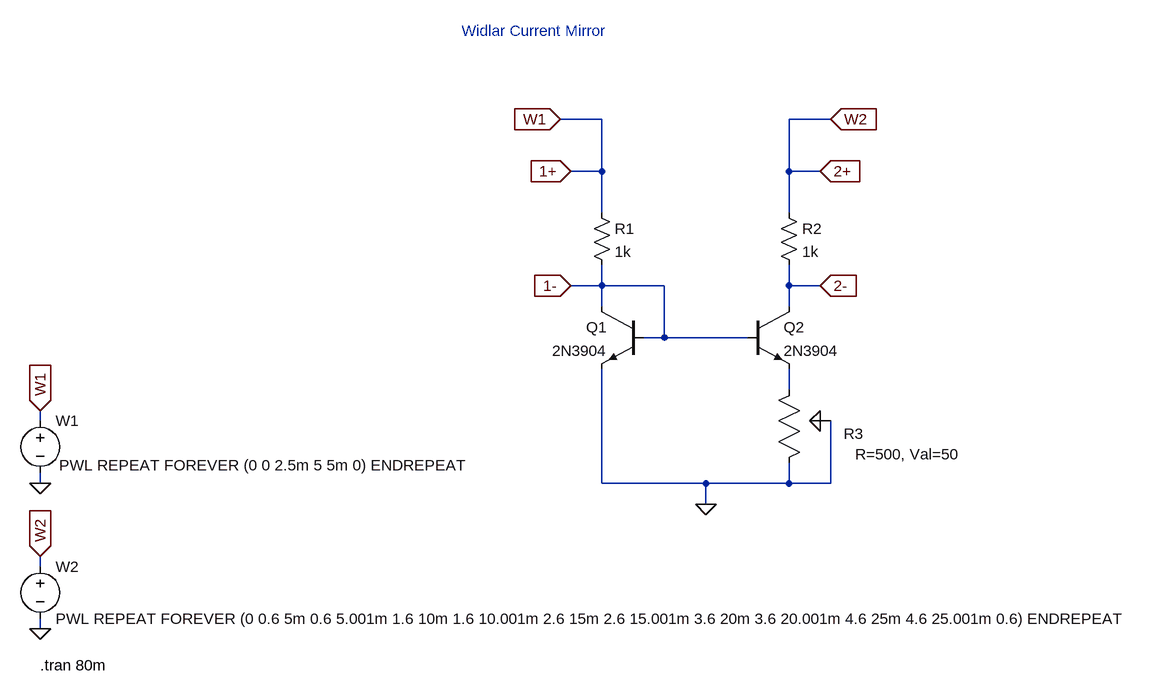
[diagram p0: schematic widlar_current_mirror.asc]
widlar_current_mirror.asc, the LTspice schematic file:
Version 4
SHEET 1 2016 1044
WIRE -208 -64 -272 -64
WIRE 144 -64 80 -64
WIRE -208 16 -208 -64
WIRE -208 16 -256 16
WIRE 80 16 80 -64
WIRE 128 16 80 16
WIRE -208 80 -208 16
WIRE 80 80 80 16
WIRE -208 192 -208 160
WIRE -208 192 -256 192
WIRE -112 192 -208 192
WIRE 80 192 80 160
WIRE 128 192 80 192
WIRE -208 224 -208 192
WIRE 80 224 80 192
WIRE -112 272 -112 192
WIRE -112 272 -144 272
WIRE 16 272 -112 272
WIRE 80 352 80 320
WIRE -1072 400 -1072 384
WIRE -1072 496 -1072 480
WIRE -208 496 -208 320
WIRE -48 496 -208 496
WIRE 80 496 80 464
WIRE 80 496 -48 496
WIRE 144 496 144 400
WIRE 144 496 80 496
WIRE -48 528 -48 496
WIRE -1072 624 -1072 608
WIRE -1072 720 -1072 704
FLAG -1072 496 0
FLAG -1072 720 0
FLAG -1072 384 W1
IOPIN -1072 384 In
FLAG -1072 608 W2
IOPIN -1072 608 In
FLAG -48 528 0
FLAG -272 -64 W1
IOPIN -272 -64 In
FLAG 144 -64 W2
IOPIN 144 -64 In
FLAG -256 16 1+
IOPIN -256 16 In
FLAG -256 192 1-
IOPIN -256 192 In
FLAG 128 16 2+
IOPIN 128 16 In
FLAG 128 192 2-
IOPIN 128 192 In
SYMBOL voltage -1072 384 R0
WINDOW 3 29 84 Left 2
WINDOW 123 0 0 Left 0
WINDOW 39 0 0 Left 0
SYMATTR Value PWL REPEAT FOREVER (0 0 2.5m 5 5m 0) ENDREPEAT
SYMATTR InstName W1
SYMBOL voltage -1072 608 R0
WINDOW 123 0 0 Left 0
WINDOW 39 0 0 Left 0
SYMATTR InstName W2
SYMATTR Value PWL REPEAT FOREVER (0 0.6 5m 0.6 5.001m 1.6 10m 1.6 10.001m 2.6 15m 2.6 15.001m 3.6 20m 3.6 20.001m 4.6 25m 4.6 25.001m 0.6) ENDREPEAT
SYMBOL res -224 64 R0
SYMATTR InstName R1
SYMATTR Value 1k
SYMBOL res 64 64 R0
SYMATTR InstName R2
SYMATTR Value 1k
SYMBOL npn -144 224 M0
SYMATTR InstName Q1
SYMATTR Value 2N3904
SYMBOL npn 16 224 R0
SYMATTR InstName Q2
SYMATTR Value 2N3904
SYMBOL potentiometer 96 368 M0
WINDOW 0 -99 52 Left 2
WINDOW 39 -247 83 Left 2
SYMATTR InstName R3
SYMATTR SpiceLine R=500, Val=50
TEXT -424 -200 Left 2 ;Widlar Current Mirror
TEXT -1072 776 Left 2 !.tran 80m

The netlist it stands for:
* widlar_current_mirror.asc
V§W1 1+ 0 PWL REPEAT FOREVER (0 0 2.5m 5 5m 0) ENDREPEAT
V§W2 2+ 0 PWL REPEAT FOREVER (0 0.6 5m 0.6 5.001m 1.6 10m 1.6 10.001m 2.6 15m 2.6 15.001m 3.6 20m 3.6 20.001m 4.6 25m 4.6 25.001m 0.6) ENDREPEAT
R1 1+ 1- 1k
R2 2+ 2- 1k
Q1 1- 1- 0 0 2N3904
Q2 2- 1- N001 0 2N3904
XR3 N001 0 0 potentiometer R=500, Val=50  ; pins 1 2 3
.model NPN NPN
.model PNP PNP
.lib standard.bjt
* Widlar Current Mirror
.tran 80m
.backanno
.end